# Altium schematic sheet 5V_SIGNAL_BULKHEAD.SchDoc
size A4
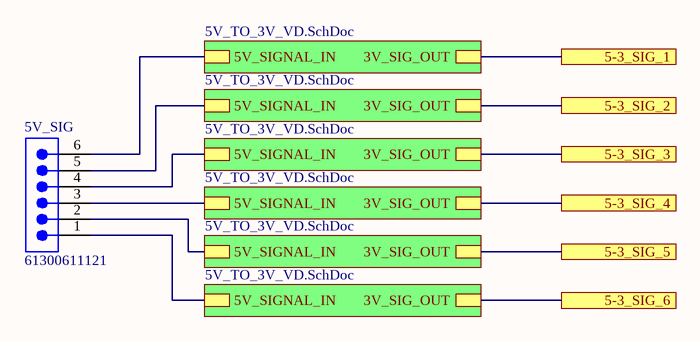
[diagram p0: 5V_SIGNAL_BULKHEAD.SchDoc]

## Parts
5V_SIG  61300611121  [61300611121]

## Sub-sheets
Designator = 5V_TO_3V_VD.SchDoc: 5V_SIGNAL_IN, 3V_SIG_OUT
Designator = 5V_TO_3V_VD.SchDoc: 5V_SIGNAL_IN, 3V_SIG_OUT
Designator = 5V_TO_3V_VD.SchDoc: 5V_SIGNAL_IN, 3V_SIG_OUT
Designator = 5V_TO_3V_VD.SchDoc: 5V_SIGNAL_IN, 3V_SIG_OUT
Designator = 5V_TO_3V_VD.SchDoc: 5V_SIGNAL_IN, 3V_SIG_OUT
Designator = 5V_TO_3V_VD.SchDoc: 5V_SIGNAL_IN, 3V_SIG_OUT

## Ports
5-3_SIG_1, 5-3_SIG_2, 5-3_SIG_3, 5-3_SIG_4, 5-3_SIG_5, 5-3_SIG_6

## Nets
5-3_SIG_1: port 5-3_SIG_1, sheet Designator/3V_SIG_OUT
5-3_SIG_2: port 5-3_SIG_2, sheet Designator/3V_SIG_OUT
5-3_SIG_3: port 5-3_SIG_3, sheet Designator/3V_SIG_OUT
5-3_SIG_4: port 5-3_SIG_4, sheet Designator/3V_SIG_OUT
5-3_SIG_5: port 5-3_SIG_5, sheet Designator/3V_SIG_OUT
5-3_SIG_6: port 5-3_SIG_6, sheet Designator/3V_SIG_OUT
Net5V_SIG_1: 5V_SIG.1 ; sheet Designator/5V_SIGNAL_IN
Net5V_SIG_2: 5V_SIG.2 ; sheet Designator/5V_SIGNAL_IN
Net5V_SIG_3: 5V_SIG.3 ; sheet Designator/5V_SIGNAL_IN
Net5V_SIG_4: 5V_SIG.4 ; sheet Designator/5V_SIGNAL_IN
Net5V_SIG_5: 5V_SIG.5 ; sheet Designator/5V_SIGNAL_IN
Net5V_SIG_6: 5V_SIG.6 ; sheet Designator/5V_SIGNAL_IN

## Library data of the parts
5V_SIG = CMP-1502-01070-2: NexarPartId: 20084590; Operating Supply Voltage: 250V; Current Rating: 3A; Number of Contacts: 6; Gender: Male; Connector Type: Male Pin; Pitch: 2.54mm; Contact Resistance: 20mΩ; Lead Free: Lead Free; REACH SVHC: Unknown; Number of Rows: 1; Color: Black; Min Operating Temperature: -40°C; Contact Material: Copper; Lead Pitch: 2.54mm; Contact Plating: Gold; Number of Pins: 6; Height: 8.89mm; Orientation: Vertical; Termination: Through Hole; Mount: Through Hole; RoHS: Compliant; Contact Gender: Male; Contact Mating Length: 5.9944mm; Voltage Rating: 250V; Number of Positions: 6; Housing Material: PBT; Packaging: Bulk; Max Operating Temperature: 105°C